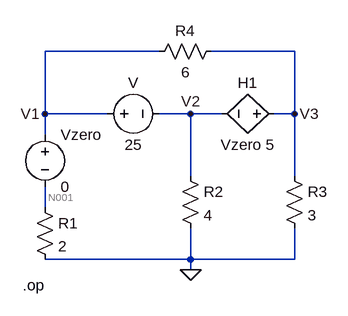
[diagram p0: schematic dependent_source_1.asc]
dependent_source_1.asc, the LTspice schematic file:
Version 4
SHEET 1 880 680
WIRE 224 -48 48 -48
WIRE 432 -48 304 -48
WIRE 48 48 48 -48
WIRE 144 48 48 48
WIRE 272 48 224 48
WIRE 320 48 272 48
WIRE 432 48 432 -48
WIRE 432 48 400 48
WIRE 48 80 48 48
WIRE 272 144 272 48
WIRE 432 144 432 48
WIRE 48 192 48 160
WIRE 272 272 272 224
WIRE 272 272 48 272
WIRE 432 272 432 224
WIRE 432 272 272 272
WIRE 272 288 272 272
FLAG 272 288 0
FLAG 48 48 V1
FLAG 272 48 V2
FLAG 432 48 V3
SYMBOL res 32 176 R0
SYMATTR InstName R1
SYMATTR Value 2
SYMBOL res 256 128 R0
SYMATTR InstName R2
SYMATTR Value 4
SYMBOL res 416 128 R0
SYMATTR InstName R3
SYMATTR Value 3
SYMBOL res 320 -64 R90
WINDOW 0 0 56 VBottom 2
WINDOW 3 32 56 VTop 2
SYMATTR InstName R4
SYMATTR Value 6
SYMBOL voltage 128 48 R270
WINDOW 0 32 56 VTop 2
WINDOW 3 -32 56 VBottom 2
SYMATTR InstName V
SYMATTR Value 25
SYMBOL voltage 48 64 R0
SYMATTR InstName Vzero
SYMATTR Value 0
SYMBOL h 416 48 R90
WINDOW 0 -32 56 VBottom 2
WINDOW 3 32 56 VTop 2
SYMATTR InstName H1
SYMATTR Value Vzero 5
TEXT 14 312 Left 2 !.op

The netlist it stands for:
* dependent_source_1.asc
R1 N001 0 2
R2 V2 0 4
R3 V3 0 3
R4 V3 V1 6
V V1 V2 25
Vzero V1 N001 0
H1 V3 V2 Vzero 5
.op
.backanno
.end

* Results of the author's LTspice run, read from the files saved beside the schematic
* Operating Point:
*   V(n001) = 7.609 V
*   V(v2) = -17.39 V
*   V(v3) = 1.63 V
*   V(v1) = 7.609 V
*   I(H1) = 452.9 mA
*   I(R4) = -996.4 mA
*   I(R3) = 543.5 mA
*   I(R2) = -4.348 A
*   I(R1) = 3.804 A
*   I(Vzero) = 3.804 A
*   I(V) = -4.801 A